# Altium project Radio_SI4432.PrjPcb
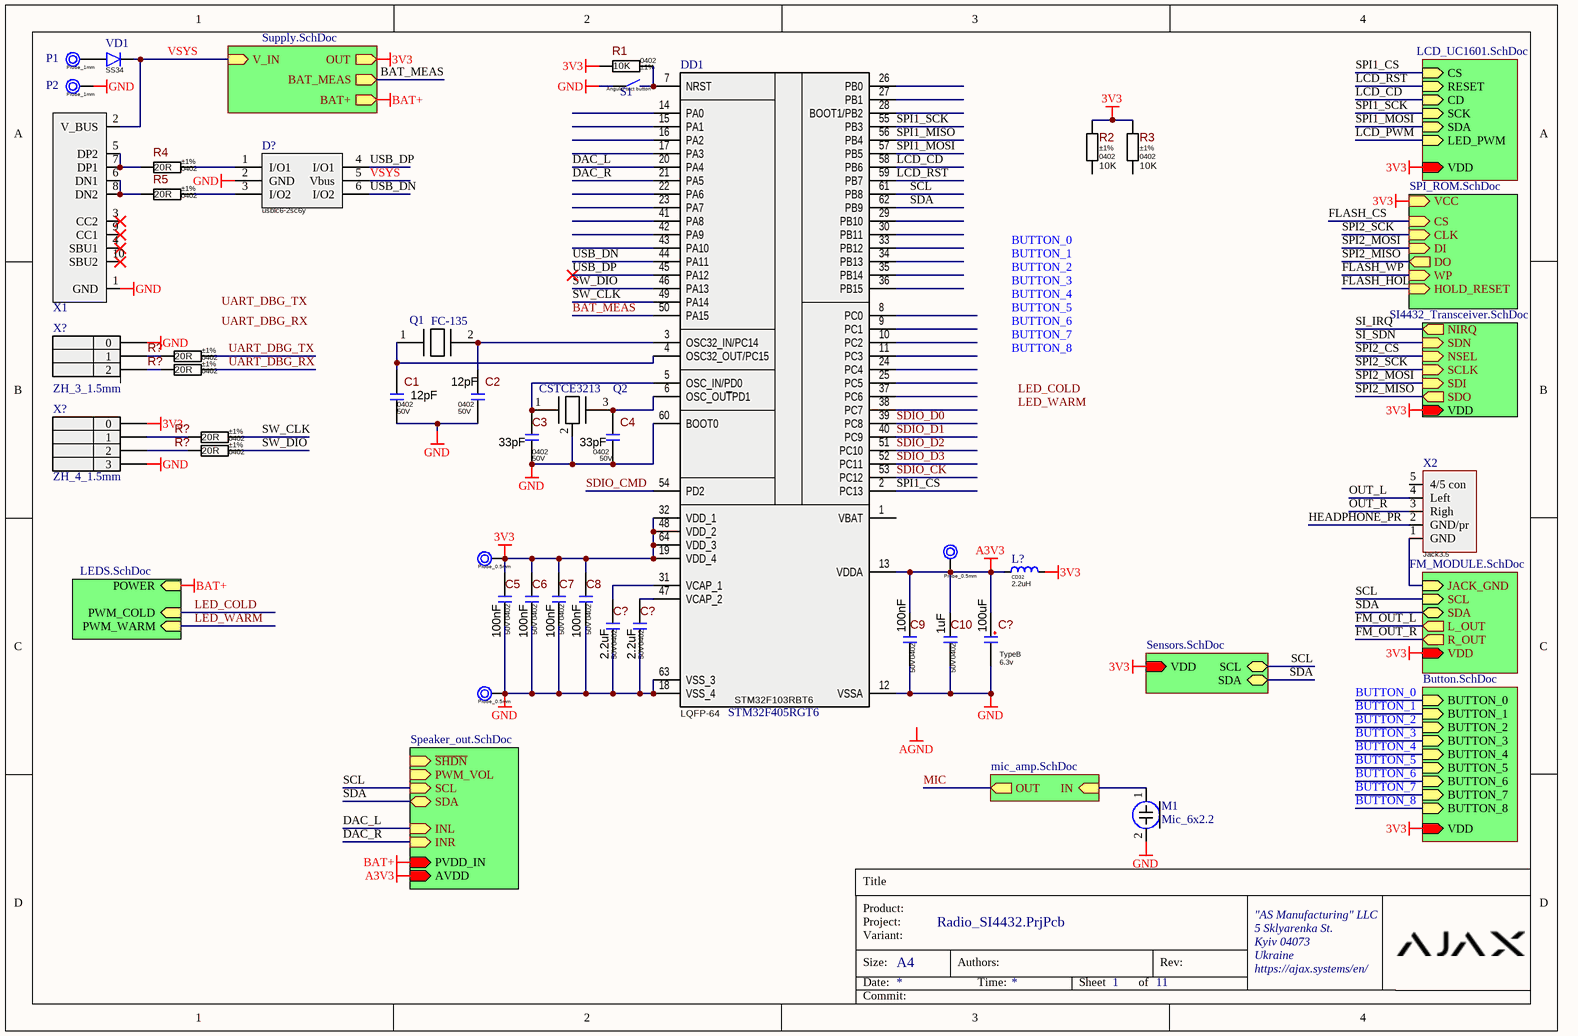
[diagram p0: Main.SchDoc]
11 sheets, 180 parts. Net scope: hierarchical (ports join the sheet entries above them; power ports are global).
Board file: PCB1.PcbDoc
Sheets:
  Main.SchDoc
    Designator = LCD_UC1601.SchDoc
    Designator = Speaker_out.SchDoc
    Designator = Supply.SchDoc
    Designator = SI4432_Transceiver.SchDoc
    Designator = FM_MODULE.SchDoc
    Designator = Button.SchDoc
    IN = mic_amp.SchDoc
    Designator = LEDS.SchDoc
    Designator = SPI_ROM.SchDoc
    Designator = Sensors.SchDoc

## Sheet Main.SchDoc: =DocumentName
size A4; CompanyName: "AS Manufacturing" LLC; Organization: "AS Manufacturing" LLC; Address1: 5 Sklyarenka St.; Address2: Kyiv 04073; Address3: Ukraine; Address4: https://ajax.systems/en/; SheetNumber: 1; SheetTotal: 11; Template_version: 1.0.1

### Parts
(Parts that share a designator on the sheet are numbered #1, #2 ... from top to bottom, then left to right.)
C1  Package: 0402  Voltage: 50V  [Cap_0402]  (hidden comment: 12pF)
C2  Package: 0402  Voltage: 50V  [Cap_0402]  (hidden comment: 12pF)
C3  Package: 0402  Voltage: 50V  [Cap_0402]  (hidden comment: 33pF)
C4  Package: 0402  Voltage: 50V  [Cap_0402]  (hidden comment: 33pF)
C5  Package: 0402  Voltage: 50V  [Cap_0402]  (hidden comment: 100nF)
C6  Package: 0402  Voltage: 50V  [Cap_0402]  (hidden comment: 100nF)
C7  Package: 0402  Voltage: 50V  [Cap_0402]  (hidden comment: 100nF)
C8  Package: 0402  Voltage: 50V  [Cap_0402]  (hidden comment: 100nF)
C9  Package: 0402  Voltage: 50V  [Cap_0402]  (hidden comment: 100nF)
C10  Package: 0402  Voltage: 50V  [Cap_0402]  (hidden comment: 1uF)
C?#1  Package: 0402  Voltage: 50V  [Cap_0402]  (hidden comment: 2.2uF)
C?#2  Package: 0402  Voltage: 50V  [Cap_0402]  (hidden comment: 2.2uF)
C?#3  Package: TypeB  Voltage: 6.3v  [Tantalum TYPE-B]  (hidden comment: 100uF)
D?#1  usblc6-2sc6y  [SOT23-6]
DD1  STM32F405RGT6  Name: STM32F103RBT6  [LQFP-64]
L?#1  value 2.2uH  [CD32]  (hidden comment: CD32)
M1  Mic_6x2.2  [Electret mic 6x2.2]
P1  Probe_1mm  [Probe_1mm]
P2  Probe_1mm  [Probe_1mm]
P15  Probe_0.5mm  [Probe_0.5mm]
P16  Probe_0.5mm  [Probe_0.5mm]
P17  Probe_0.5mm  [Probe_0.5mm]
Q1  FC-135  [Quarz FC-135]
Q2  CSTCE3213  [Quartz MEMS CSTCE]
R1  value 10K  Tolerance: ±1%  Package: 0402  [Res_0402]  (hidden comment: Res_0402_10K)
R2  value 10K  Tolerance: ±1%  Package: 0402  [Res_0402]  (hidden comment: Res_0402_10K)
R3  value 10K  Tolerance: ±1%  Package: 0402  [Res_0402]  (hidden comment: Res_0402_10K)
R4  value 20R  Tolerance: ±1%  Package: 0402  [Res_0402]  (hidden comment: Res_0402_20R)
R5  value 20R  Tolerance: ±1%  Package: 0402  [Res_0402]  (hidden comment: Res_0402_20R)
R?#1  value 20R  Tolerance: ±1%  Package: 0402  [Res_0402]  (hidden comment: Res_0402_20R)
R?#2  value 20R  Tolerance: ±1%  Package: 0402  [Res_0402]  (hidden comment: Res_0402_20R)
R?#3  value 20R  Tolerance: ±1%  Package: 0402  [Res_0402]  (hidden comment: Res_0402_20R)
R?#4  value 20R  Tolerance: ±1%  Package: 0402  [Res_0402]  (hidden comment: Res_0402_20R)
S1  Angular tact button  [Tact_button_3X6X3.5mm]
VD1  SS34  [DO-214AA]
X1  Type-c  [Type-c_0.8]  (value not drawn)
X2  Name: Jack3.5  [Jack3.5_male]  (hidden comment: Jack3.5_male)
X?#1  ZH_3_1.5mm  [ZH_3_1.5mm]
X?#2  ZH_4_1.5mm  [ZH_4_1.5mm]

### Sub-sheets
Designator = LCD_UC1601.SchDoc: CS (in), RESET (in), CD (in), SCK (in), SDA (in), LED_PWM (in), VDD (in)
Designator = Speaker_out.SchDoc: ~{SHDN} (in), PWM_VOL (in), SCL (in), SDA (bidir), INL (in), INR (in), PVDD_IN (in), AVDD (in)
Designator = Supply.SchDoc: OUT (out), V_IN (in), BAT_MEAS (out), BAT+ (out)
Designator = SI4432_Transceiver.SchDoc: NIRQ (out), SDN (in), NSEL (in), SCLK (in), SDI (in), SDO (out), VDD (in)
Designator = FM_MODULE.SchDoc: SCL (in), SDA (bidir), L_OUT (out), R_OUT (out), VDD (in), JACK_GND (in)
Designator = Button.SchDoc: BUTTON_0 (in), VDD (in), BUTTON_1 (in), BUTTON_2 (in), BUTTON_3 (in), BUTTON_4 (in), BUTTON_5 (in), BUTTON_6 (in), BUTTON_7 (in), BUTTON_8 (in)
Designator = LEDS.SchDoc: POWER (in), PWM_COLD (in), PWM_WARM (in)
Designator = SPI_ROM.SchDoc: VCC (in), CS (in), CLK (in), DI (in), DO (out), WP (in), HOLD_RESET (in)
Designator = Sensors.SchDoc: VDD (in), SDA (bidir), SCL (bidir)
IN = mic_amp.SchDoc: OUT (out), IN (in)

### Nets
3V3: C5.1 C6.1 C7.1 C8.1 DD1.19(VDD_4) DD1.32(VDD_1) DD1.48(VDD_2) DD1.64(VDD_3) L?#1.1 P15.1(probe_point) R1.1 R2.1 R3.1 X?#2.0 ; sheet Designator/VDD, sheet Designator/OUT, sheet Designator/VDD, sheet Designator/VDD, sheet Designator/VDD, sheet Designator/VCC, sheet Designator/VDD
A3V3: C9.1 C10.1 C?#3.1 DD1.13(VDDA) L?#1.2 P16.1(probe_point) ; sheet Designator/AVDD
BAT+: sheet Designator/PVDD_IN, sheet Designator/BAT+, sheet Designator/POWER
GND: C1.2 C2.2 C3.2 C4.2 C5.2 C6.2 C7.2 C8.2 C9.2 C10.2 C?#1.2 C?#2.2 C?#3.2 D?#1.2(GND) DD1.12(VSSA) DD1.18(VSS_4) DD1.60(BOOT0) DD1.63(VSS_3) M1.2 P2.1(probe_point) P17.1(probe_point) Q2.2 S1.1 X1.1(GND) X?#1.0 X?#2.3
BAT_MEAS: DD1.50(PA15) ; sheet Designator/BAT_MEAS
DAC_L: DD1.20(PA4) ; sheet Designator/INL
DAC_R: DD1.21(PA5) ; sheet Designator/INR
HEADPHONE_PR: X2.2(GND/pr)
LCD_CD: DD1.58(PB6) ; sheet Designator/CD
LCD_RST: DD1.59(PB7) ; sheet Designator/RESET
OUT_L: X2.4(Left)
OUT_R: X2.3(Righ)
SCL: DD1.61(PB8) ; sheet Designator/SCL, sheet Designator/SCL, sheet Designator/SCL
SDA: DD1.62(PB9) ; sheet Designator/SDA, sheet Designator/SDA, sheet Designator/SDA
SDIO_CK: DD1.53(PC12)
SDIO_CMD: DD1.54(PD2)
SDIO_D0: DD1.39(PC8)
SDIO_D1: DD1.40(PC9)
SDIO_D2: DD1.51(PC10)
SDIO_D3: DD1.52(PC11)
SPI1_CS: DD1.2(PC13) ; sheet Designator/CS
SPI1_MISO: DD1.56(PB4)
SPI1_MOSI: DD1.57(PB5) ; sheet Designator/SDA
SPI1_SCK: DD1.55(PB3) ; sheet Designator/SCK
SPI2_MISO: sheet Designator/SDO, sheet Designator/DO
SPI2_MOSI: sheet Designator/SDI, sheet Designator/DI
SPI2_SCK: sheet Designator/SCLK, sheet Designator/CLK
SW_CLK: DD1.49(PA14) R?#3.2
SW_DIO: DD1.46(PA13) R?#4.2
UART_DBG_RX: R?#2.2
UART_DBG_TX: R?#1.2
USB_DN: D?#1.6(I/O2) DD1.44(PA11)
USB_DP: D?#1.4(I/O1) DD1.45(PA12)
VSYS: D?#1.5(Vbus) VD1.2(C) X1.2(V_BUS) ; sheet Designator/V_IN
NetC1_1: C1.1 DD1.4(OSC32_OUT/PC15) Q1.1(probe_point)
NetC2_1: C2.1 DD1.3(OSC32_IN/PC14) Q1.2(probe_point)
NetC3_1: C3.1 DD1.5(OSC_IN/PD0) Q2.1(probe_point)
NetC4_1: C4.1 DD1.6(OSC_OU~{T}PD1) Q2.3(probe_point)
NetC33_1: X2.1(GND) ; sheet Designator/JACK_GND
NetC46_1: M1.1 ; sheet IN/IN
NetC?#1_1: C?#1.1 DD1.31(VCAP_1)
NetC?#2_1: C?#2.1 DD1.47(VCAP_2)
NetD?#1_1: D?#1.1(I/O1) R4.2
NetD?#1_3: D?#1.3(I/O2) R5.2
NetDD1_7: DD1.7(NRST) R1.2 S1.2
NetP1_1: P1.1(probe_point) VD1.1(A)
NetR4_1: R4.1 X1.5(DP2) X1.7(DP1)
NetR5_1: R5.1 X1.6(DN1) X1.8(DN2)
NetR?#1_1: R?#1.1 X?#1.1
NetR?#2_1: R?#2.1 X?#1.2
NetR?#3_1: R?#3.1 X?#2.1
NetR?#4_1: R?#4.1 X?#2.2

Not connected (* = marked no-connect by the designer): DD1 1(VBAT) 8(PC0) 9(PC1) 10(PC2) 11(PC3) 14(PA0) 15(PA1) 16(PA2) 17(PA3) 22(PA6) 23(PA7) 24(PC4) 25(PC5) 26(PB0) 27(PB1) 28(BOOT1/PB2) 29(PB10) 30(PB11) 33(PB12) 34(PB13) 35(PB14) 36(PB15) 37(PC6) 38(PC7) 41(PA8) 42(PA9) 43(PA10); R2 2; R3 2; X1 3(CC2)* 4(SBU1)* 9(CC1)* 10(SBU2)*; X2 5(4/5_con)

### Notes on the sheet
- Labels drawn without touching a wire or pin: AGND, BUTTON_0, BUTTON_1, BUTTON_2, BUTTON_3, BUTTON_4, BUTTON_5, BUTTON_6, BUTTON_7, BUTTON_8, LED_COLD, LED_WARM, UART_DBG_RX, UART_DBG_TX
- Title
- Product:
- Project:
- Size:
- Date:
- Variant:
- A4
- Authors:
- Time:
- Sheet
- of
- Rev:
- Commit:

### Library data of the parts
C1 C2 = Cap_0402_12pF: 12pF 50V  ±25% 0402 Ceramic Capacitor; Component Type: SMD; Tolerance: ±25%; ComponentLink1URL: https://search.murata.co.jp/Ceramy/image/img/A01X/G101/ENG/GRM31CR60J107ME39-01.pdf; ComponentLink1Description: Datasheet; Value: 12pF
C3 C4 = Cap_0402_33pF: 33pF 50V  ±25% 0402 Ceramic Capacitor; Component Type: SMD; Tolerance: ±25%; ComponentLink1URL: https://search.murata.co.jp/Ceramy/image/img/A01X/G101/ENG/GRM31CR60J107ME39-01.pdf; ComponentLink1Description: Datasheet; Value: 33pF
C5-C9 = Cap_0402_100nF: 100nF 50V  ±25% 0402 Ceramic Capacitor; Component Type: SMD; Tolerance: ±25%; ComponentLink1URL: https://search.murata.co.jp/Ceramy/image/img/A01X/G101/ENG/GRM31CR60J107ME39-01.pdf; ComponentLink1Description: Datasheet; Value: 100nF
C10 = Cap_0402_1uF: 1uF 50V  ±25% 0402 Ceramic Capacitor; Component Type: SMD; Tolerance: ±25%; ComponentLink1URL: https://search.murata.co.jp/Ceramy/image/img/A01X/G101/ENG/GRM31CR60J107ME39-01.pdf; ComponentLink1Description: Datasheet; Value: 1uF
C?#1 C?#2 = Cap_0402_2.2uF: 2.2uF 50V  ±25% 0402 Ceramic Capacitor; Component Type: SMD; Tolerance: ±25%; ComponentLink1URL: https://search.murata.co.jp/Ceramy/image/img/A01X/G101/ENG/GRM31CR60J107ME39-01.pdf; ComponentLink1Description: Datasheet; Value: 2.2uF
C?#3 = Cap_TypeB_100uF: Tantalum_TYPE-B 100uF 6.3V; Tolerance: ±25%; ComponentLink1URL: https://search.murata.co.jp/Ceramy/image/img/A01X/G101/ENG/GRM31CR60J107ME39-01.pdf; ComponentLink1Description: Datasheet; Component Type: SMD; Value: 100uF
DD1 = STM32F405RGT6: ARM Cortex-M3 MCU with 1024 kB Flash 192kB ROM, 168 MHz CPU, LQFP-64; Manufacturer: STMicroelectronics; Component Type: SMD; Package: LQFP-64
L?#1 = CD32: 2.2uH; Size: CD32
Q1 = Quarz 32.768kHz: Parameter 1: *
Q2 = CSTCE3213: QUARZ 8MHz; Parameter 1: *
R1-R3 = Res_0402_10K: ±1% 1/16W 0402; Power Rating: 0.062W; Voltage: 50V; ComponentLink1URL: https://www.yageo.com/upload/media/product/productsearch/datasheet/rchip/PYu-RC_Group_51_RoHS_L_10.pdf; ComponentLink1Description: Datasheet
R4 R5 R?#1-R?#4 = Res_0402_20R: ±1% 1/16W 0402; Power Rating: 0.062W; Voltage: 50V; ComponentLink1URL: https://www.yageo.com/upload/media/product/productsearch/datasheet/rchip/PYu-RC_Group_51_RoHS_L_10.pdf; ComponentLink1Description: Datasheet
S1 = Angular tact button: 3X6X3.5mm; Name: Angular tact button
VD1 = SS34: Shotky diode 40v 3A (drop 0.75v 3A); Name: SS34
X1 = USB_Type-c_0.8mm
D?#1 = usblc6-2sc6y: Name: usblc6-2sc6y
P1 P2 = Probe_1mm: Value: Probe_1mm
P15-P17 = Probe_0.5mm: Value: Probe_0.5mm

## Sheet LCD_UC1601.SchDoc
size A4; SheetNumber: 3; SheetTotal: 11
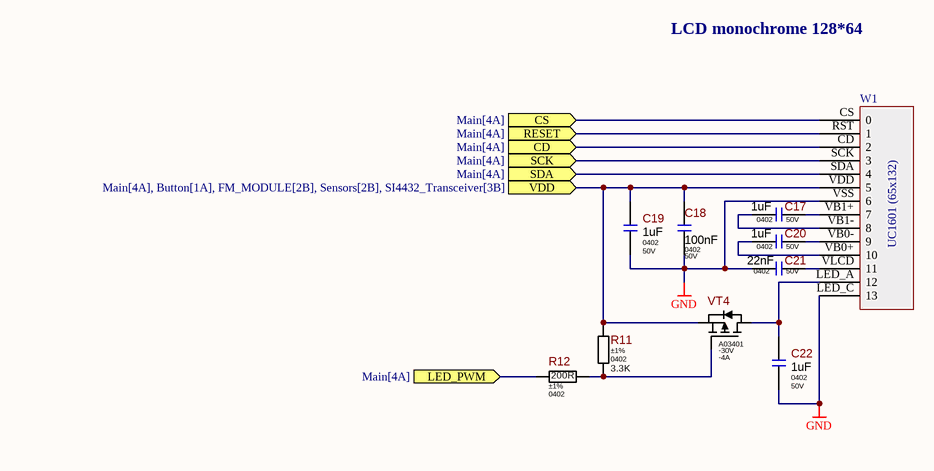
[diagram p1: LCD_UC1601.SchDoc]

### Parts
C17  Package: 0402  Voltage: 50V  [Cap_0402]  (hidden comment: 1uF)
C18  Package: 0402  Voltage: 50V  [Cap_0402]  (hidden comment: 100nF)
C19  Package: 0402  Voltage: 50V  [Cap_0402]  (hidden comment: 1uF)
C20  Package: 0402  Voltage: 50V  [Cap_0402]  (hidden comment: 1uF)
C21  Package: 0402  Voltage: 50V  [Cap_0402]  (hidden comment: 22nF)
C22  Package: 0402  Voltage: 50V  [Cap_0402]  (hidden comment: 1uF)
R11  value 3.3K  Tolerance: ±1%  Package: 0402  [Res_0402]  (hidden comment: Res_0402_3.3K)
R12  value 200R  Tolerance: ±1%  Package: 0402  [Res_0402]  (hidden comment: Res_0402_200R)
VT4  Vds: -30V  Id: -4A  [SOT-23]  (hidden comment: A03401)
W1  LCD_UC1601s  [LCD_connector_14PIN_0.5mm]  (value not drawn)

### Ports
CD (in, see Main[4A]), CS (in, see Main[4A]), LED_PWM (in, see Main[4A]), RESET (in, see Main[4A]), SCK (in, see Main[4A]), SDA (in, see Main[4A]), VDD (in, see Main[4A], Button[1A], FM_MODULE[2B], Sensors[2B], SI4432_Transceiver[3B])

### Nets
3V3: C18.1 C19.1 R11.2 VT4.2(S) W1.VDD(5) ; port VDD
GND: C18.2 C19.2 C21.1 C22.2 W1.LED_C(13) W1.VSS(6)
LCD_CD: W1.CD(2) ; port CD
LCD_PWM: R12.1 ; port LED_PWM
LCD_RST: W1.RST(1) ; port RESET
SPI1_CS: W1.CS(0) ; port CS
SPI1_MOSI: W1.SDA(4) ; port SDA
SPI1_SCK: W1.SCK(3) ; port SCK
NetC17_1: C17.1 W1.VB1-(8)
NetC17_2: C17.2 W1.VB1+(7)
NetC20_1: C20.1 W1.VB0+(10)
NetC20_2: C20.2 W1.VB0-(9)
NetC21_2: C21.2 W1.VLCD(11)
NetC22_1: C22.1 VT4.3(D) W1.LED_A(12)
NetR11_1: R11.1 R12.2 VT4.1(G)

### Notes on the sheet
- LCD monochrome 128*64
- (in symbol LCD_UC1601s) UC1601 (65x132)

### Library data of the parts
C17 C19 C20 C22 = Cap_0402_1uF: 1uF 50V  ±25% 0402 Ceramic Capacitor; Component Type: SMD; Tolerance: ±25%; ComponentLink1URL: https://search.murata.co.jp/Ceramy/image/img/A01X/G101/ENG/GRM31CR60J107ME39-01.pdf; ComponentLink1Description: Datasheet; Value: 1uF
C18 = Cap_0402_100nF: 100nF 50V  ±25% 0402 Ceramic Capacitor; Component Type: SMD; Tolerance: ±25%; ComponentLink1URL: https://search.murata.co.jp/Ceramy/image/img/A01X/G101/ENG/GRM31CR60J107ME39-01.pdf; ComponentLink1Description: Datasheet; Value: 100nF
C21 = Cap_0402_22nF: 22nF 50V  ±25% 0402 Ceramic Capacitor; Component Type: SMD; Tolerance: ±25%; ComponentLink1URL: https://search.murata.co.jp/Ceramy/image/img/A01X/G101/ENG/GRM31CR60J107ME39-01.pdf; ComponentLink1Description: Datasheet; Value: 22nF
R11 = Res_0402_3.3K: ±1% 1/16W 0402; Power Rating: 0.062W; Voltage: 50V; ComponentLink1URL: https://www.yageo.com/upload/media/product/productsearch/datasheet/rchip/PYu-RC_Group_51_RoHS_L_10.pdf; ComponentLink1Description: Datasheet
R12 = Res_0402_200R: ±1% 1/16W 0402; Power Rating: 0.062W; Voltage: 50V; ComponentLink1URL: https://www.yageo.com/upload/media/product/productsearch/datasheet/rchip/PYu-RC_Group_51_RoHS_L_10.pdf; ComponentLink1Description: Datasheet
VT4 = A03401: -30V, -4A max P-Channel  MOSFET, 60mOhm @ Vgs = -4.5V; Part Type: N-Channel; Component Type: SMD; ComponentLink1URL: https://datasheetspdf.com/pdf-file/767558/Alpha&OmegaSemiconductors/AO3416/1; ComponentLink1Description: Datasheet; Package: SOT-23; Rds: 60mOhm; Name: A03401

## Sheet Speaker_out.SchDoc: =DocumentName
size A4; CompanyName: "AS Manufacturing" LLC; Organization: "AS Manufacturing" LLC; Address1: 5 Sklyarenka St.; Address2: Kyiv 04073; Address3: Ukraine; Address4: https://ajax.systems/en/; SheetNumber: 2; SheetTotal: 11; Template_version: 1.0.1
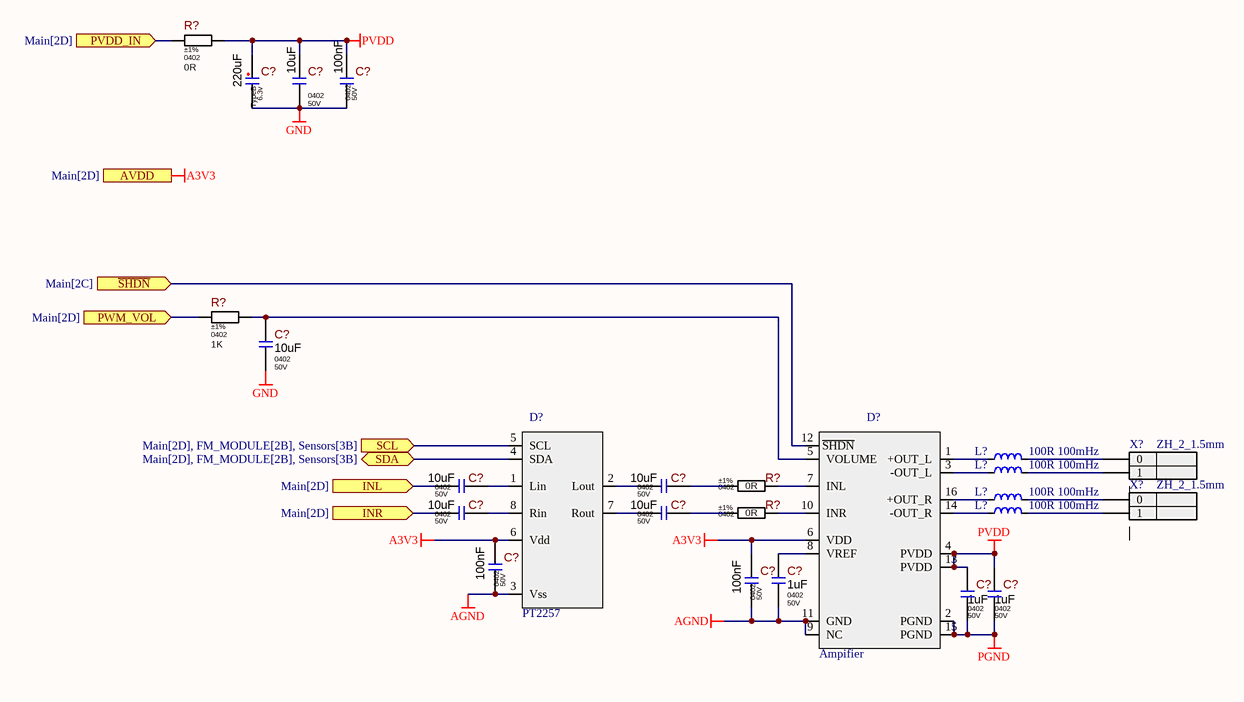
[diagram p2: Speaker_out.SchDoc]

### Parts
(Parts that share a designator on the sheet are numbered #1, #2 ... from top to bottom, then left to right.)
C?#4  Package: TypeB  Voltage: 6.3v  [Tantalum TYPE-B]  (hidden comment: 220uF)
C?#5  Package: 0402  Voltage: 50V  [Cap_0402]  (hidden comment: 10uF)
C?#6  Package: 0402  Voltage: 50V  [Cap_0402]  (hidden comment: 100nF)
C?#7  Package: 0402  Voltage: 50V  [Cap_0402]  (hidden comment: 10uF)
C?#8  Package: 0402  Voltage: 50V  [Cap_0402]  (hidden comment: 10uF)
C?#9  Package: 0402  Voltage: 50V  [Cap_0402]  (hidden comment: 10uF)
C?#10  Package: 0402  Voltage: 50V  [Cap_0402]  (hidden comment: 10uF)
C?#11  Package: 0402  Voltage: 50V  [Cap_0402]  (hidden comment: 10uF)
C?#12  Package: 0402  Voltage: 50V  [Cap_0402]  (hidden comment: 100nF)
C?#13  Package: 0402  Voltage: 50V  [Cap_0402]  (hidden comment: 100nF)
C?#14  Package: 0402  Voltage: 50V  [Cap_0402]  (hidden comment: 1uF)
C?#15  Package: 0402  Voltage: 50V  [Cap_0402]  (hidden comment: 1uF)
C?#16  Package: 0402  Voltage: 50V  [Cap_0402]  (hidden comment: 1uF)
D?#2  PT2257  [SOP8]
D?#3  Ampifier  [SOP16]
L?#2  100R 100mHz  [Cap_0805]
L?#3  100R 100mHz  [Cap_0805]
L?#4  100R 100mHz  [Cap_0805]
L?#5  100R 100mHz  [Cap_0805]
R?#5  value 0R  Tolerance: ±1%  Package: 0402  [Res_0402]  (hidden comment: Res_0402_0R)
R?#6  value 1K  Tolerance: ±1%  Package: 0402  [Res_0402]  (hidden comment: Res_0402_1K)
R?#7  value 0R  Tolerance: ±1%  Package: 0402  [Res_0402]  (hidden comment: Res_0402_0R)
R?#8  value 0R  Tolerance: ±1%  Package: 0402  [Res_0402]  (hidden comment: Res_0402_0R)
X?#3  ZH_2_1.5mm  [ZH_2_1.5mm]
X?#4  ZH_2_1.5mm  [ZH_2_1.5mm]

### Ports
AVDD (in, see Main[2D]), INL (in, see Main[2D]), INR (in, see Main[2D]), PVDD_IN (in, see Main[2D]), PWM_VOL (in, see Main[2D]), SCL (in, see Main[2D], FM_MODULE[2B], Sensors[3B]), SDA (bidir, see Main[2D], FM_MODULE[2B], Sensors[3B]), ~{SHDN} (in, see Main[2C])

### Nets
A3V3: C?#12.1 C?#13.1 D?#2.6(Vdd) D?#3.6(VDD) ; port AVDD
AGND: C?#12.2 C?#13.2 C?#14.2 D?#2.3(Vss) D?#3.9(NC) D?#3.11(GND)
BAT+: R?#5.1 ; port PVDD_IN
GND: C?#4.2 C?#5.2 C?#6.2 C?#7.2
PGND: C?#15.2 C?#16.2 D?#3.2(PGND) D?#3.15(PGND)
PVDD: C?#4.1 C?#5.1 C?#6.1 C?#15.1 C?#16.1 D?#3.4(PVDD) D?#3.13(PVDD) R?#5.2
DAC_L: C?#8.1 ; port INL
DAC_R: C?#10.1 ; port INR
SCL: D?#2.5(SCL) ; port SCL
SDA: D?#2.4(SDA) ; port SDA
NetC?#7_1: C?#7.1 D?#3.5(VOLUME) R?#6.2
NetC?#8_2: C?#8.2 D?#2.1(Lin)
NetC?#9_1: C?#9.1 D?#2.2(Lout)
NetC?#9_2: C?#9.2 R?#7.1
NetC?#10_2: C?#10.2 D?#2.8(Rin)
NetC?#11_1: C?#11.1 D?#2.7(Rout)
NetC?#11_2: C?#11.2 R?#8.1
NetC?#14_1: C?#14.1 D?#3.8(VREF)
NetD?#3_1: D?#3.1(+OUT_L) L?#2.1
NetD?#3_3: D?#3.3(-OUT_L) L?#3.1
NetD?#3_7: D?#3.7(INL) R?#7.2
NetD?#3_10: D?#3.10(INR) R?#8.2
NetD?#3_12: D?#3.12(~{SHDN}) ; port ~{SHDN}
NetD?#3_14: D?#3.14(-OUT_R) L?#5.1
NetD?#3_16: D?#3.16(+OUT_R) L?#4.1
NetL?#2_2: L?#2.2 X?#3.0
NetL?#3_2: L?#3.2 X?#3.1
NetL?#4_2: L?#4.2 X?#4.0
NetL?#5_2: L?#5.2 X?#4.1
NetR?#6_1: R?#6.1 ; port PWM_VOL

### Notes on the sheet
- Title
- Product:
- Project:
- Size:
- Date:
- Variant:
- A4
- Authors:
- Time:
- Sheet
- of
- Rev:
- Commit:

### Library data of the parts
C?#4 = Cap_TypeB_220uF: Tantalum_TYPE-B 220uF 6.3V; Tolerance: ±25%; ComponentLink1URL: https://search.murata.co.jp/Ceramy/image/img/A01X/G101/ENG/GRM31CR60J107ME39-01.pdf; ComponentLink1Description: Datasheet; Component Type: SMD; Value: 220uF
C?#5 C?#7-C?#11 = Cap_0402_10uF: 10uF 50V  ±25% 0402 Ceramic Capacitor; Component Type: SMD; Tolerance: ±25%; ComponentLink1URL: https://search.murata.co.jp/Ceramy/image/img/A01X/G101/ENG/GRM31CR60J107ME39-01.pdf; ComponentLink1Description: Datasheet; Value: 10uF
C?#6 C?#12 C?#13 = Cap_0402_100nF: 100nF 50V  ±25% 0402 Ceramic Capacitor; Component Type: SMD; Tolerance: ±25%; ComponentLink1URL: https://search.murata.co.jp/Ceramy/image/img/A01X/G101/ENG/GRM31CR60J107ME39-01.pdf; ComponentLink1Description: Datasheet; Value: 100nF
C?#14-C?#16 = Cap_0402_1uF: 1uF 50V  ±25% 0402 Ceramic Capacitor; Component Type: SMD; Tolerance: ±25%; ComponentLink1URL: https://search.murata.co.jp/Ceramy/image/img/A01X/G101/ENG/GRM31CR60J107ME39-01.pdf; ComponentLink1Description: Datasheet; Value: 1uF
D?#2 = PT2257: Digital potentiometr
D?#3 = PAM8003: Amplifier 2.5W class-d stereo / 64-Step DC Volume Control
L?#2-L?#5 = FerriteBead_0805_100R_100Mhz_1
R?#5 R?#7 R?#8 = Res_0402_0R: ±1% 1/16W 0402; Power Rating: 0.062W; Voltage: 50V; ComponentLink1URL: https://www.yageo.com/upload/media/product/productsearch/datasheet/rchip/PYu-RC_Group_51_RoHS_L_10.pdf; ComponentLink1Description: Datasheet
R?#6 = Res_0402_1K: ±1% 1/16W 0402; Power Rating: 0.062W; Voltage: 50V; ComponentLink1URL: https://www.yageo.com/upload/media/product/productsearch/datasheet/rchip/PYu-RC_Group_51_RoHS_L_10.pdf; ComponentLink1Description: Datasheet

## Sheet Supply.SchDoc: =DocumentName
size A4; CompanyName: "AS Manufacturing" LLC; Organization: "AS Manufacturing" LLC; Address1: 5 Sklyarenka St.; Address2: Kyiv 04073; Address3: Ukraine; Address4: https://ajax.systems/en/; SheetNumber: 1; SheetTotal: 1; Template_version: 1.0.1
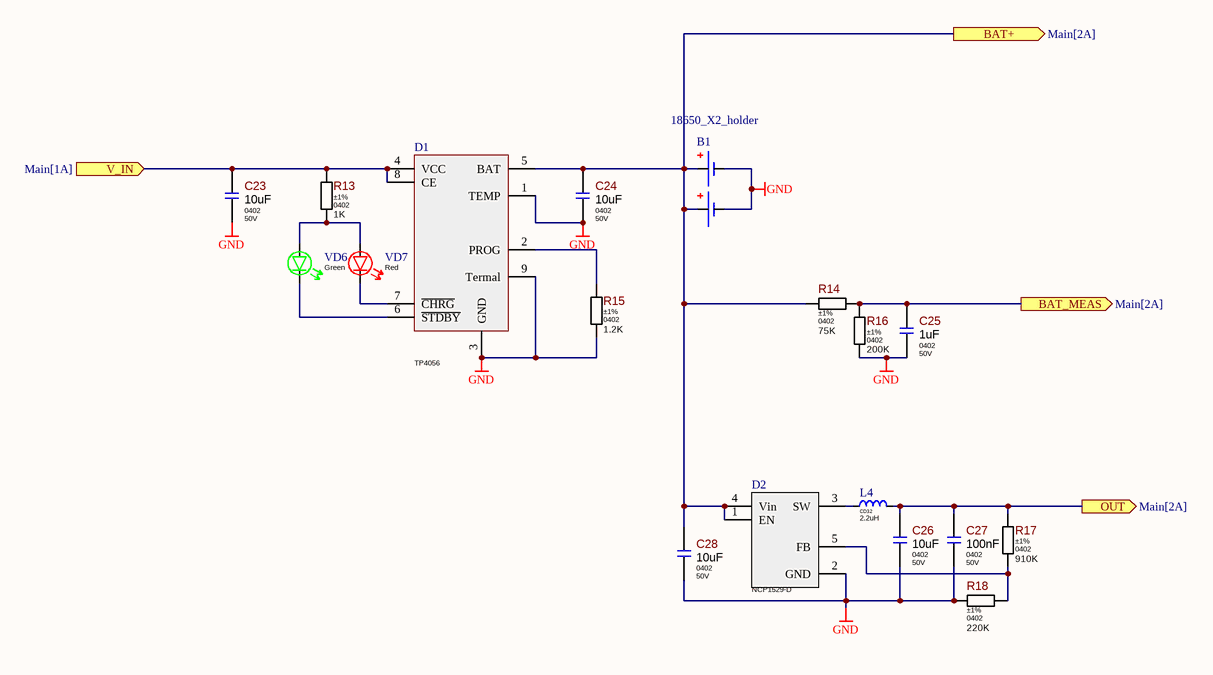
[diagram p3: Supply.SchDoc]

### Parts
B1  18650_X2_holder  [18650_X2]
C23  Package: 0402  Voltage: 50V  [Cap_0402]  (hidden comment: 10uF)
C24  Package: 0402  Voltage: 50V  [Cap_0402]  (hidden comment: 10uF)
C25  Package: 0402  Voltage: 50V  [Cap_0402]  (hidden comment: 1uF)
C26  Package: 0402  Voltage: 50V  [Cap_0402]  (hidden comment: 10uF)
C27  Package: 0402  Voltage: 50V  [Cap_0402]  (hidden comment: 100nF)
C28  Package: 0402  Voltage: 50V  [Cap_0402]  (hidden comment: 10uF)
D1  TP4056  [SOP-8-with thermal pad]
D2  NCP1529-D  [SOT-23-5]
L4  value 2.2uH  [CD32]  (hidden comment: CD32)
R13  value 1K  Tolerance: ±1%  Package: 0402  [Res_0402]  (hidden comment: Res_0402_1K)
R14  value 75K  Tolerance: ±1%  Package: 0402  [Res_0402]  (hidden comment: Res_0402_75K)
R15  value 1.2K  Tolerance: ±1%  Package: 0402  [Res_0402]  (hidden comment: Res_0402_1.2K)
R16  value 200K  Tolerance: ±1%  Package: 0402  [Res_0402]  (hidden comment: Res_0402_200K)
R17  value 910K  Tolerance: ±1%  Package: 0402  [Res_0402]  (hidden comment: Res_0402_910K)
R18  value 220K  Tolerance: ±1%  Package: 0402  [Res_0402]  (hidden comment: Res_0402_220K)
VD6  Color: Green  [0805_LED_GREEN]  (hidden comment: 0805_LED_GREEN)
VD7  Color: Red  [0805_LED_RED]  (hidden comment: 0805_LED_RED)

### Ports
BAT+ (out, see Main[2A]), BAT_MEAS (out, see Main[2A]), OUT (out, see Main[2A]), V_IN (in, see Main[1A])

### Nets
3V3: C26.1 C27.1 L4.2 R17.1 ; port OUT
BAT+: B1.1(+) B1.3(+) C24.1 C28.1 D1.5(BAT) D2.1(EN) D2.4(Vin) R14.1 ; port BAT+
GND: B1.2(-) B1.4(-) C23.2 C24.2 C25.1 C26.2 C27.2 C28.2 D1.1(TEMP) D1.3(GND) D1.9(Termal) D2.2(GND) R15.2 R16.2 R18.2
BAT_MEAS: C25.2 R14.2 R16.1 ; port BAT_MEAS
VSYS: C23.1 D1.4(VCC) D1.8(CE) R13.1 ; port V_IN
NetD1_2: D1.2(PROG) R15.1
NetD1_6: D1.6(~{STDBY}) VD6.2(C)
NetD1_7: D1.7(~{CHRG}) VD7.2(C)
NetD2_3: D2.3(SW) L4.1
NetD2_5: D2.5(FB) R17.2 R18.1
NetR13_2: R13.2 VD6.1(A) VD7.1(A)

### Notes on the sheet
- Title
- Product:
- Project:
- Size:
- Date:
- Variant:
- A4
- Authors:
- Time:
- Sheet
- of
- Rev:
- Commit:

### Library data of the parts
C23 C24 C26 C28 = Cap_0402_10uF: 10uF 50V  ±25% 0402 Ceramic Capacitor; Component Type: SMD; Tolerance: ±25%; ComponentLink1URL: https://search.murata.co.jp/Ceramy/image/img/A01X/G101/ENG/GRM31CR60J107ME39-01.pdf; ComponentLink1Description: Datasheet; Value: 10uF
C25 = Cap_0402_1uF: 1uF 50V  ±25% 0402 Ceramic Capacitor; Component Type: SMD; Tolerance: ±25%; ComponentLink1URL: https://search.murata.co.jp/Ceramy/image/img/A01X/G101/ENG/GRM31CR60J107ME39-01.pdf; ComponentLink1Description: Datasheet; Value: 1uF
C27 = Cap_0402_100nF: 100nF 50V  ±25% 0402 Ceramic Capacitor; Component Type: SMD; Tolerance: ±25%; ComponentLink1URL: https://search.murata.co.jp/Ceramy/image/img/A01X/G101/ENG/GRM31CR60J107ME39-01.pdf; ComponentLink1Description: Datasheet; Value: 100nF
D1 = TP4056: Lion Charger 1A; Name: TP4056
D2 = NCP1529-D: In 2.7-5.5v 1A 1.7MHz DC-DC; Name: NCP1529-D
L4 = CD32: 2.2uH; Size: CD32
R13 = Res_0402_1K: as R?#6 on sheet Speaker_out; ComponentLink1URL: https://www.yageo.com/upload/media/product/productsearch/datasheet/rchip/PYu-RC_Group_51_RoHS_L_10.pdf; ComponentLink1Description: Datasheet
R14 = Res_0402_75K: ±1% 1/16W 0402; Power Rating: 0.062W; Voltage: 50V; ComponentLink1URL: https://www.yageo.com/upload/media/product/productsearch/datasheet/rchip/PYu-RC_Group_51_RoHS_L_10.pdf; ComponentLink1Description: Datasheet
R15 = Res_0402_1.2K: ±1% 1/16W 0402; Power Rating: 0.062W; Voltage: 50V; ComponentLink1URL: https://www.yageo.com/upload/media/product/productsearch/datasheet/rchip/PYu-RC_Group_51_RoHS_L_10.pdf; ComponentLink1Description: Datasheet
R16 = Res_0402_200K: ±1% 1/16W 0402; Power Rating: 0.062W; Voltage: 50V; ComponentLink1URL: https://www.yageo.com/upload/media/product/productsearch/datasheet/rchip/PYu-RC_Group_51_RoHS_L_10.pdf; ComponentLink1Description: Datasheet
R17 = Res_0402_910K: ±1% 1/16W 0402; Power Rating: 0.062W; Voltage: 50V; ComponentLink1URL: https://www.yageo.com/upload/media/product/productsearch/datasheet/rchip/PYu-RC_Group_51_RoHS_L_10.pdf; ComponentLink1Description: Datasheet
R18 = Res_0402_220K: ±1% 1/16W 0402; Power Rating: 0.062W; Voltage: 50V; ComponentLink1URL: https://www.yageo.com/upload/media/product/productsearch/datasheet/rchip/PYu-RC_Group_51_RoHS_L_10.pdf; ComponentLink1Description: Datasheet
VD6 = 0805_LED_GREEN: V=3v - 3.2v / I=20mA
VD7 = 0805_LED_RED: V=2v - 2.2v / I=20mA

## Sheet SI4432_Transceiver.SchDoc
size A4; SheetNumber: 5; SheetTotal: 11
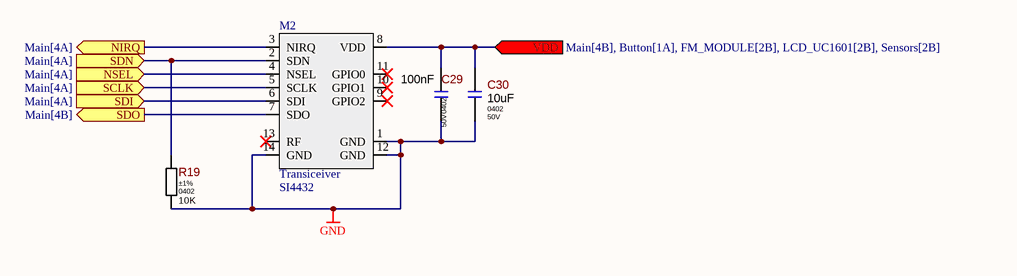
[diagram p4: SI4432_Transceiver.SchDoc]

### Parts
C29  Package: 0402  Voltage: 50V  [Cap_0402]  (hidden comment: 100nF)
C30  Package: 0402  Voltage: 50V  [Cap_0402]  (hidden comment: 10uF)
M2  Transiceiver  [SI4432]
R19  value 10K  Tolerance: ±1%  Package: 0402  [Res_0402]  (hidden comment: Res_0402_10K)

### Ports
NIRQ (out, see Main[4A]), NSEL (in, see Main[4A]), SCLK (in, see Main[4A]), SDI (in, see Main[4A]), SDN (in, see Main[4A]), SDO (out, see Main[4B]), VDD (in, see Main[4B], Button[1A], FM_MODULE[2B], LCD_UC1601[2B], Sensors[2B])

### Nets
3V3: C29.1 C30.1 M2.8(VDD) ; port VDD
GND: C29.2 C30.2 M2.1(GND) M2.12(GND) M2.14(GND) R19.2
SI_IRQ: M2.3(NIRQ) ; port NIRQ
SI_SDN: M2.2(SDN) R19.1 ; port SDN
SPI2_CS: M2.4(NSEL) ; port NSEL
SPI2_MISO: M2.7(SDO) ; port SDO
SPI2_MOSI: M2.6(SDI) ; port SDI
SPI2_SCK: M2.5(SCLK) ; port SCLK

Not connected (* = marked no-connect by the designer): M2 9(GPIO2)* 10(GPIO1)* 11(GPIO0)* 13(RF)*

### Library data of the parts
C29 = Cap_0402_100nF: 100nF 50V  ±25% 0402 Ceramic Capacitor; Component Type: SMD; Tolerance: ±25%; ComponentLink1URL: https://search.murata.co.jp/Ceramy/image/img/A01X/G101/ENG/GRM31CR60J107ME39-01.pdf; ComponentLink1Description: Datasheet; Value: 100nF
C30 = Cap_0402_10uF: 10uF 50V  ±25% 0402 Ceramic Capacitor; Component Type: SMD; Tolerance: ±25%; ComponentLink1URL: https://search.murata.co.jp/Ceramy/image/img/A01X/G101/ENG/GRM31CR60J107ME39-01.pdf; ComponentLink1Description: Datasheet; Value: 10uF
M2 = SI4432: Name: SI4432
R19 = Res_0402_10K: as R1 on sheet Main; ComponentLink1URL: https://www.yageo.com/upload/media/product/productsearch/datasheet/rchip/PYu-RC_Group_51_RoHS_L_10.pdf; ComponentLink1Description: Datasheet

## Sheet FM_MODULE.SchDoc
size A4; SheetNumber: 6; SheetTotal: 11
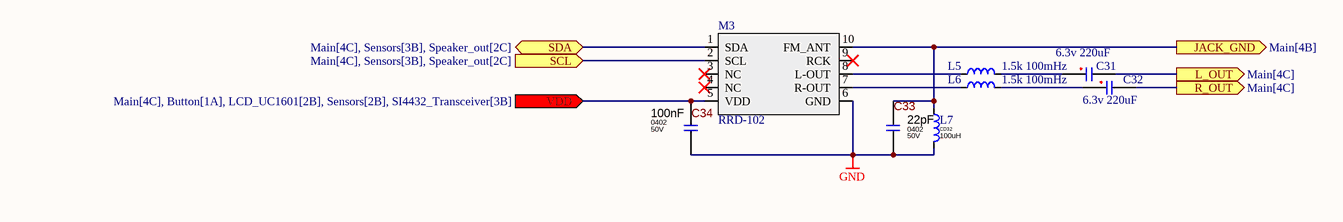
[diagram p5: FM_MODULE.SchDoc]

### Parts
C31  6.3v 220uF  [Tantalum TYPE-B]
C32  6.3v 220uF  [Tantalum TYPE-B]
C33  Package: 0402  Voltage: 50V  [Cap_0402]  (hidden comment: 22pF)
C34  Package: 0402  Voltage: 50V  [Cap_0402]  (hidden comment: 100nF)
L5  1.5k 100mHz  [Cap_0805]
L6  1.5k 100mHz  [Cap_0805]
L7  value 100uH  [CD32]  (hidden comment: CD32)
M3  RRD-102  [RRD-102]

### Ports
JACK_GND (out, see Main[4B]), L_OUT (out, see Main[4C]), R_OUT (out, see Main[4C]), SCL (in, see Main[4C], Sensors[3B], Speaker_out[2C]), SDA (bidir, see Main[4C], Sensors[3B], Speaker_out[2C]), VDD (in, see Main[4C], Button[1A], LCD_UC1601[2B], Sensors[2B], SI4432_Transceiver[3B])

### Nets
3V3: C34.1 M3.5(VDD) ; port VDD
GND: C33.2 C34.2 L7.2 M3.6(GND)
FM_OUT_L: C31.2 ; port L_OUT
FM_OUT_R: C32.2 ; port R_OUT
SCL: M3.2(SCL) ; port SCL
SDA: M3.1(SDA) ; port SDA
NetC31_1: C31.1 L5.2
NetC32_1: C32.1 L6.2
NetC33_1: C33.1 L7.1 M3.10(FM_ANT) ; port JACK_GND
NetL5_1: L5.1 M3.8(L-OUT)
NetL6_1: L6.1 M3.7(R-OUT)

Not connected (* = marked no-connect by the designer): M3 3(NC)* 4(NC)* 9(RCK)*

### Library data of the parts
C31 C32 = Tantalum_TYPE-B
C33 = Cap_0402_22pF: 22pF 50V  ±25% 0402 Ceramic Capacitor; Component Type: SMD; Tolerance: ±25%; ComponentLink1URL: https://search.murata.co.jp/Ceramy/image/img/A01X/G101/ENG/GRM31CR60J107ME39-01.pdf; ComponentLink1Description: Datasheet; Value: 22pF
C34 = Cap_0402_100nF: 100nF 50V  ±25% 0402 Ceramic Capacitor; Component Type: SMD; Tolerance: ±25%; ComponentLink1URL: https://search.murata.co.jp/Ceramy/image/img/A01X/G101/ENG/GRM31CR60J107ME39-01.pdf; ComponentLink1Description: Datasheet; Value: 100nF
L5 L6 = 0805
L7 = CD32: 2.2uH; Size: CD32
M3 = RRD-102(RDA5807M)

## Sheet Button.SchDoc
size A4; SheetNumber: 7; SheetTotal: 11
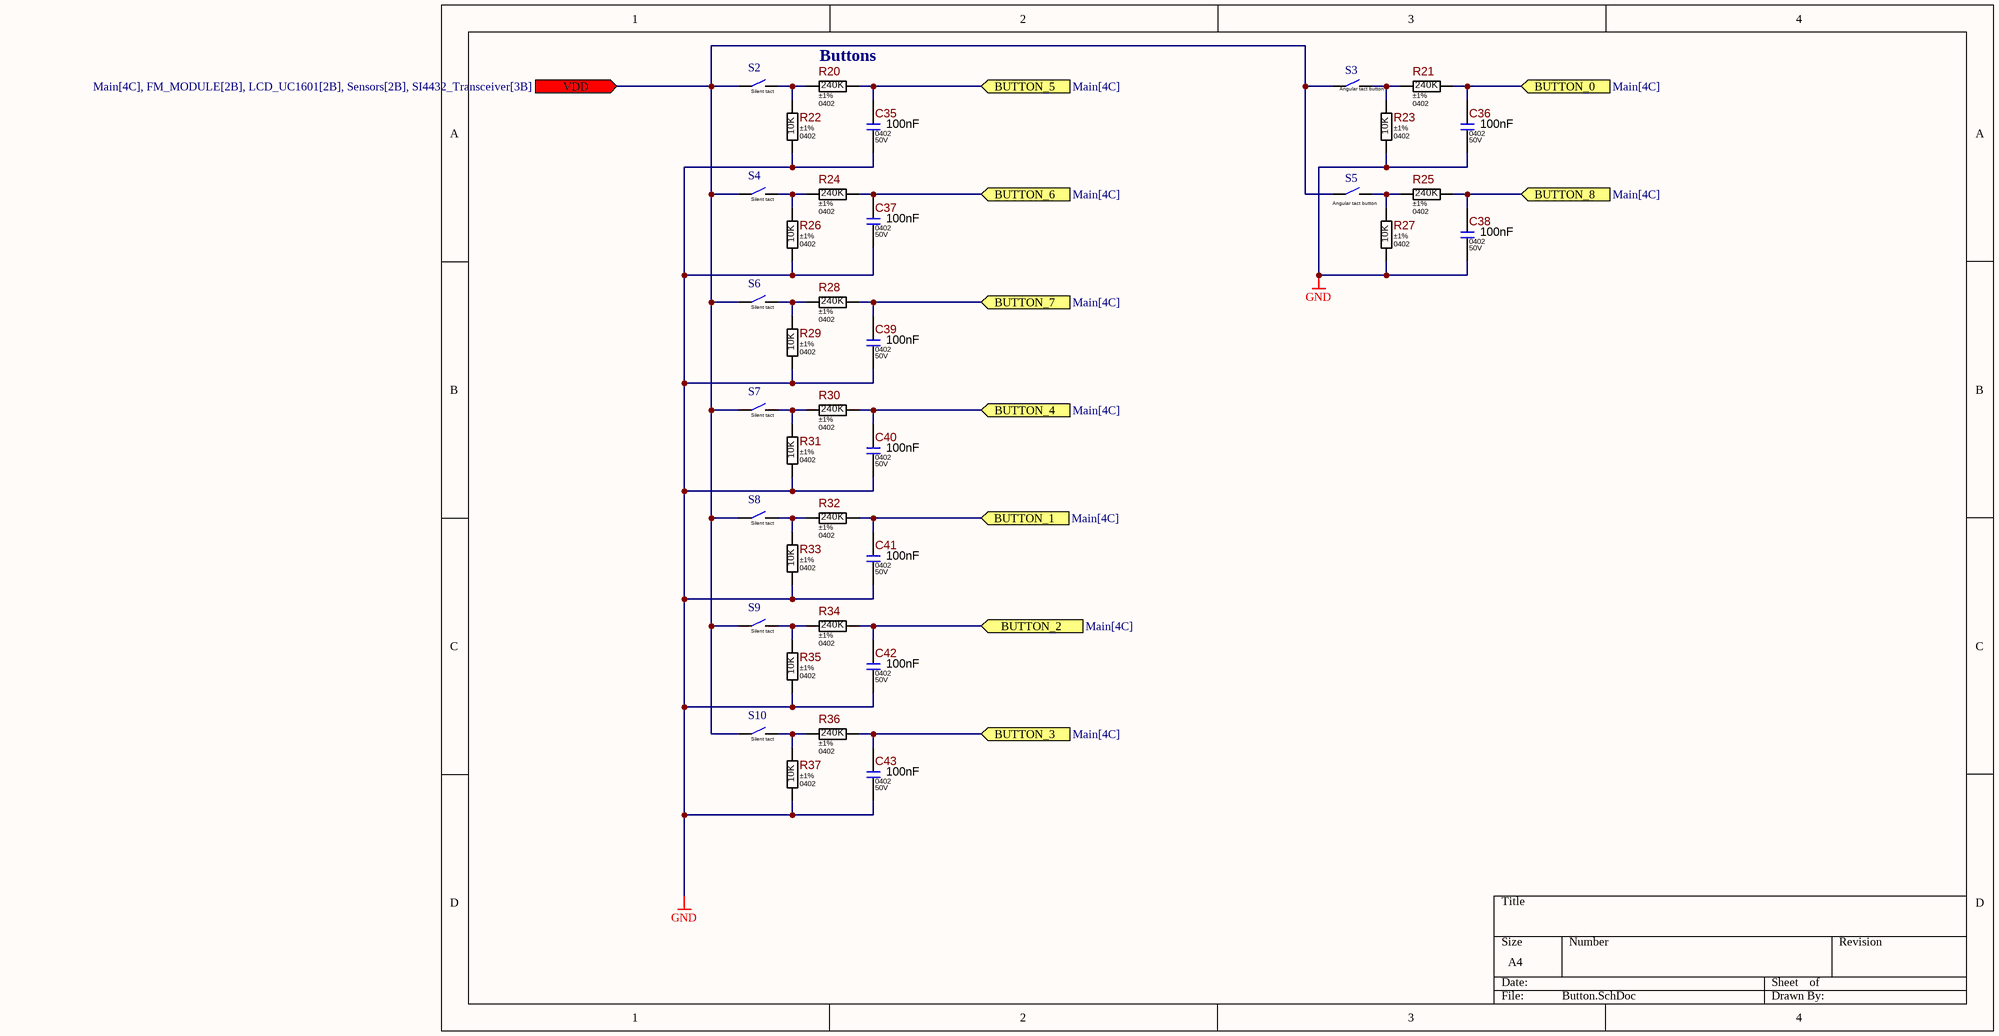
[diagram p6: Button.SchDoc]

### Parts
C35  Package: 0402  Voltage: 50V  [Cap_0402]  (hidden comment: 100nF)
C36  Package: 0402  Voltage: 50V  [Cap_0402]  (hidden comment: 100nF)
C37  Package: 0402  Voltage: 50V  [Cap_0402]  (hidden comment: 100nF)
C38  Package: 0402  Voltage: 50V  [Cap_0402]  (hidden comment: 100nF)
C39  Package: 0402  Voltage: 50V  [Cap_0402]  (hidden comment: 100nF)
C40  Package: 0402  Voltage: 50V  [Cap_0402]  (hidden comment: 100nF)
C41  Package: 0402  Voltage: 50V  [Cap_0402]  (hidden comment: 100nF)
C42  Package: 0402  Voltage: 50V  [Cap_0402]  (hidden comment: 100nF)
C43  Package: 0402  Voltage: 50V  [Cap_0402]  (hidden comment: 100nF)
R20  value 240K  Tolerance: ±1%  Package: 0402  [Res_0402]  (hidden comment: Res_0402_240K)
R21  value 240K  Tolerance: ±1%  Package: 0402  [Res_0402]  (hidden comment: Res_0402_240K)
R22  value 10K  Tolerance: ±1%  Package: 0402  [Res_0402]  (hidden comment: Res_0402_10K)
R23  value 10K  Tolerance: ±1%  Package: 0402  [Res_0402]  (hidden comment: Res_0402_10K)
R24  value 240K  Tolerance: ±1%  Package: 0402  [Res_0402]  (hidden comment: Res_0402_240K)
R25  value 240K  Tolerance: ±1%  Package: 0402  [Res_0402]  (hidden comment: Res_0402_240K)
R26  value 10K  Tolerance: ±1%  Package: 0402  [Res_0402]  (hidden comment: Res_0402_10K)
R27  value 10K  Tolerance: ±1%  Package: 0402  [Res_0402]  (hidden comment: Res_0402_10K)
R28  value 240K  Tolerance: ±1%  Package: 0402  [Res_0402]  (hidden comment: Res_0402_240K)
R29  value 10K  Tolerance: ±1%  Package: 0402  [Res_0402]  (hidden comment: Res_0402_10K)
R30  value 240K  Tolerance: ±1%  Package: 0402  [Res_0402]  (hidden comment: Res_0402_240K)
R31  value 10K  Tolerance: ±1%  Package: 0402  [Res_0402]  (hidden comment: Res_0402_10K)
R32  value 240K  Tolerance: ±1%  Package: 0402  [Res_0402]  (hidden comment: Res_0402_240K)
R33  value 10K  Tolerance: ±1%  Package: 0402  [Res_0402]  (hidden comment: Res_0402_10K)
R34  value 240K  Tolerance: ±1%  Package: 0402  [Res_0402]  (hidden comment: Res_0402_240K)
R35  value 10K  Tolerance: ±1%  Package: 0402  [Res_0402]  (hidden comment: Res_0402_10K)
R36  value 240K  Tolerance: ±1%  Package: 0402  [Res_0402]  (hidden comment: Res_0402_240K)
R37  value 10K  Tolerance: ±1%  Package: 0402  [Res_0402]  (hidden comment: Res_0402_10K)
S2  Name: Silent tact  [Tact Switch_6*6*5mm]  (hidden comment: Silent Tact Switch)
S3  Angular tact button  [Tact_button_3X6X3.5mm]
S4  Name: Silent tact  [Tact Switch_6*6*5mm]  (hidden comment: Silent Tact Switch)
S5  Angular tact button  [Tact_button_3X6X3.5mm]
S6  Name: Silent tact  [Tact Switch_6*6*5mm]  (hidden comment: Silent Tact Switch)
S7  Name: Silent tact  [Tact Switch_6*6*5mm]  (hidden comment: Silent Tact Switch)
S8  Name: Silent tact  [Tact Switch_6*6*5mm]  (hidden comment: Silent Tact Switch)
S9  Name: Silent tact  [Tact Switch_6*6*5mm]  (hidden comment: Silent Tact Switch)
S10  Name: Silent tact  [Tact Switch_6*6*5mm]  (hidden comment: Silent Tact Switch)

### Ports
BUTTON_0 (in, see Main[4C]), BUTTON_1 (in, see Main[4C]), BUTTON_2 (in, see Main[4C]), BUTTON_3 (in, see Main[4C]), BUTTON_4 (in, see Main[4C]), BUTTON_5 (in, see Main[4C]), BUTTON_6 (in, see Main[4C]), BUTTON_7 (in, see Main[4C]), BUTTON_8 (in, see Main[4C]), VDD (in, see Main[4C], FM_MODULE[2B], LCD_UC1601[2B], Sensors[2B], SI4432_Transceiver[3B])

### Nets
3V3: S2.1 S3.1 S4.1 S5.1 S6.1 S7.1 S8.1 S9.1 S10.1 ; port VDD
GND: C35.2 C36.2 C37.2 C38.2 C39.2 C40.2 C41.2 C42.2 C43.2 R22.2 R23.2 R26.2 R27.2 R29.2 R31.2 R33.2 R35.2 R37.2
BUTTON_0: C36.1 R21.2 ; port BUTTON_0
BUTTON_1: C41.1 R32.2 ; port BUTTON_1
BUTTON_2: C42.1 R34.2 ; port BUTTON_2
BUTTON_3: C43.1 R36.2 ; port BUTTON_3
BUTTON_4: C40.1 R30.2 ; port BUTTON_4
BUTTON_5: C35.1 R20.2 ; port BUTTON_5
BUTTON_6: C37.1 R24.2 ; port BUTTON_6
BUTTON_7: C39.1 R28.2 ; port BUTTON_7
BUTTON_8: C38.1 R25.2 ; port BUTTON_8
NetR20_1: R20.1 R22.1 S2.2
NetR21_1: R21.1 R23.1 S3.2
NetR24_1: R24.1 R26.1 S4.2
NetR25_1: R25.1 R27.1 S5.2
NetR28_1: R28.1 R29.1 S6.2
NetR30_1: R30.1 R31.1 S7.2
NetR32_1: R32.1 R33.1 S8.2
NetR34_1: R34.1 R35.1 S9.2
NetR36_1: R36.1 R37.1 S10.2

### Notes on the sheet
- (near R20) Buttons

### Library data of the parts
C35-C43 = Cap_0402_100nF: 100nF 50V  ±25% 0402 Ceramic Capacitor; Component Type: SMD; Tolerance: ±25%; ComponentLink1URL: https://search.murata.co.jp/Ceramy/image/img/A01X/G101/ENG/GRM31CR60J107ME39-01.pdf; ComponentLink1Description: Datasheet; Value: 100nF
R20 R21 R24 R25 R28 R30 R32 R34 R36 = Res_0402_240K: ±1% 1/16W 0402; Power Rating: 0.062W; Voltage: 50V; ComponentLink1URL: https://www.yageo.com/upload/media/product/productsearch/datasheet/rchip/PYu-RC_Group_51_RoHS_L_10.pdf; ComponentLink1Description: Datasheet
R22 R23 R26 R27 R29 R31 R33 R35 R37 = Res_0402_10K: as R1 on sheet Main; ComponentLink1URL: https://www.yageo.com/upload/media/product/productsearch/datasheet/rchip/PYu-RC_Group_51_RoHS_L_10.pdf; ComponentLink1Description: Datasheet
S2 S4 S6-S10 = Silent Tact Switch: 6*6*5mm Smd Silicone Button Switch
S3 S5 = Angular tact button: 3X6X3.5mm; Name: Angular tact button

## Sheet mic_amp.SchDoc
size A4; SheetNumber: 8; SheetTotal: 11
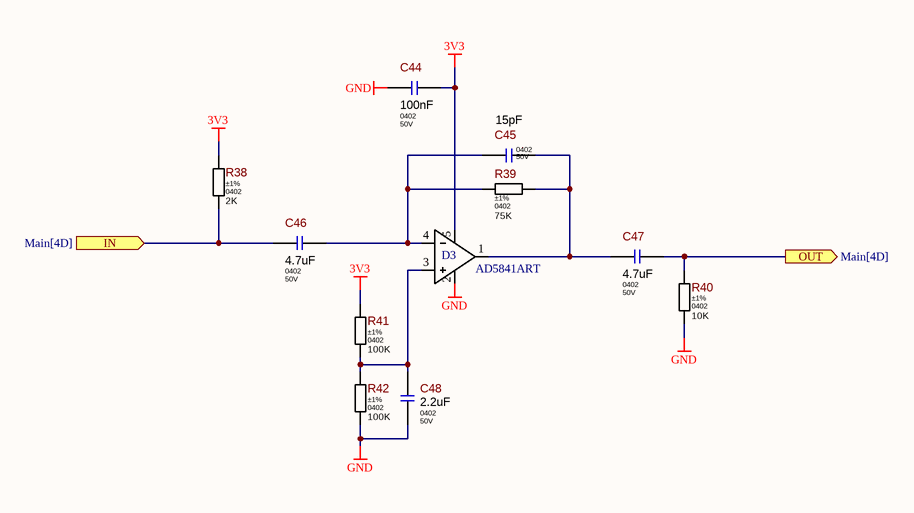
[diagram p7: mic_amp.SchDoc]

### Parts
C44  Package: 0402  Voltage: 50V  [Cap_0402]  (hidden comment: 100nF)
C45  Package: 0402  Voltage: 50V  [Cap_0402]  (hidden comment: 15pF)
C46  Package: 0402  Voltage: 50V  [Cap_0402]  (hidden comment: 4.7uF)
C47  Package: 0402  Voltage: 50V  [Cap_0402]  (hidden comment: 4.7uF)
C48  Package: 0402  Voltage: 50V  [Cap_0402]  (hidden comment: 2.2uF)
D3  AD5841ART  [SOT-23-5]
R38  value 2K  Tolerance: ±1%  Package: 0402  [Res_0402]  (hidden comment: Res_0402_2K)
R39  value 75K  Tolerance: ±1%  Package: 0402  [Res_0402]  (hidden comment: Res_0402_75K)
R40  value 10K  Tolerance: ±1%  Package: 0402  [Res_0402]  (hidden comment: Res_0402_10K)
R41  value 100K  Tolerance: ±1%  Package: 0402  [Res_0402]  (hidden comment: Res_0402_100K)
R42  value 100K  Tolerance: ±1%  Package: 0402  [Res_0402]  (hidden comment: Res_0402_100K)

### Ports
IN (in, see Main[4D]), OUT (out, see Main[4D])

### Nets
3V3: C44.2 D3.5 R38.1 R41.1
GND: C44.1 C48.2 D3.2 R40.2 R42.2
MIC: C47.2 R40.1 ; port OUT
NetC45_1: C45.1 C46.2 D3.4 R39.1
NetC45_2: C45.2 C47.1 D3.1 R39.2
NetC46_1: C46.1 R38.2 ; port IN
NetC48_1: C48.1 D3.3 R41.2 R42.1

### Library data of the parts
C44 = Cap_0402_100nF: 100nF 50V  ±25% 0402 Ceramic Capacitor; Component Type: SMD; Tolerance: ±25%; ComponentLink1URL: https://search.murata.co.jp/Ceramy/image/img/A01X/G101/ENG/GRM31CR60J107ME39-01.pdf; ComponentLink1Description: Datasheet; Value: 100nF
C45 = Cap_0402_15pF: 15pF 50V  ±25% 0402 Ceramic Capacitor; Component Type: SMD; Tolerance: ±25%; ComponentLink1URL: https://search.murata.co.jp/Ceramy/image/img/A01X/G101/ENG/GRM31CR60J107ME39-01.pdf; ComponentLink1Description: Datasheet; Value: 15pF
C46 C47 = Cap_0402_4.7uF: 4.7uF 50V  ±25% 0402 Ceramic Capacitor; Component Type: SMD; Tolerance: ±25%; ComponentLink1URL: https://search.murata.co.jp/Ceramy/image/img/A01X/G101/ENG/GRM31CR60J107ME39-01.pdf; ComponentLink1Description: Datasheet; Value: 4.7uF
C48 = Cap_0402_2.2uF: 2.2uF 50V  ±25% 0402 Ceramic Capacitor; Component Type: SMD; Tolerance: ±25%; ComponentLink1URL: https://search.murata.co.jp/Ceramy/image/img/A01X/G101/ENG/GRM31CR60J107ME39-01.pdf; ComponentLink1Description: Datasheet; Value: 2.2uF
D3 = AD5841ART: CMOS Rail to Rail 1Mhz 2.7-5.5v
R38 = Res_0402_2K: ±1% 1/16W 0402; Power Rating: 0.062W; Voltage: 50V; ComponentLink1URL: https://www.yageo.com/upload/media/product/productsearch/datasheet/rchip/PYu-RC_Group_51_RoHS_L_10.pdf; ComponentLink1Description: Datasheet
R39 = Res_0402_75K: as R14 on sheet Supply; ComponentLink1URL: https://www.yageo.com/upload/media/product/productsearch/datasheet/rchip/PYu-RC_Group_51_RoHS_L_10.pdf; ComponentLink1Description: Datasheet
R40 = Res_0402_10K: as R1 on sheet Main; ComponentLink1URL: https://www.yageo.com/upload/media/product/productsearch/datasheet/rchip/PYu-RC_Group_51_RoHS_L_10.pdf; ComponentLink1Description: Datasheet
R41 R42 = Res_0402_100K: ±1% 1/16W 0402; Power Rating: 0.062W; Voltage: 50V; ComponentLink1URL: https://www.yageo.com/upload/media/product/productsearch/datasheet/rchip/PYu-RC_Group_51_RoHS_L_10.pdf; ComponentLink1Description: Datasheet

## Sheet LEDS.SchDoc
size A4; SheetNumber: 9; SheetTotal: 11
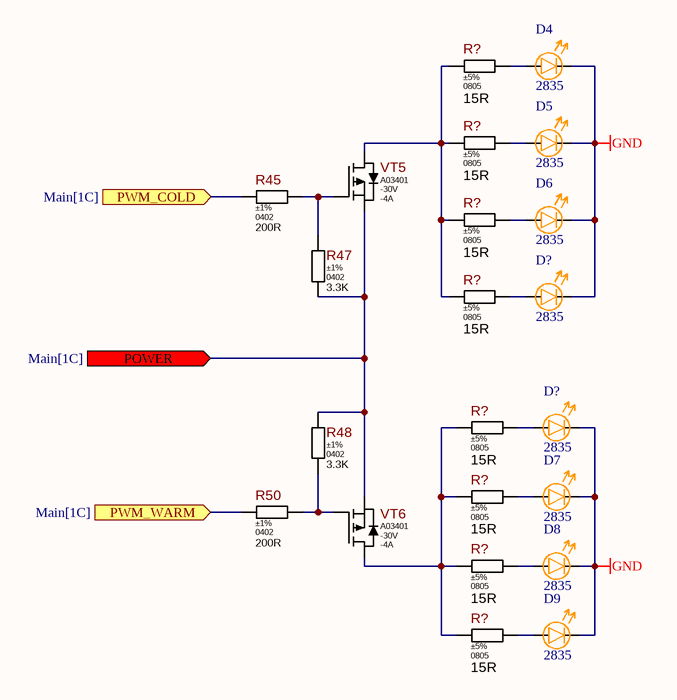
[diagram p8: LEDS.SchDoc]

### Parts
(Parts that share a designator on the sheet are numbered #1, #2 ... from top to bottom, then left to right.)
D4  2835  [2835 LED]
D5  2835  [2835 LED]
D6  2835  [2835 LED]
D7  2835  [2835 LED]
D8  2835  [2835 LED]
D9  2835  [2835 LED]
D?#4  2835  [2835 LED]
D?#5  2835  [2835 LED]
R45  value 200R  Tolerance: ±1%  Package: 0402  [Res_0402]  (hidden comment: Res_0402_200R)
R47  value 3.3K  Tolerance: ±1%  Package: 0402  [Res_0402]  (hidden comment: Res_0402_3.3K)
R48  value 3.3K  Tolerance: ±1%  Package: 0402  [Res_0402]  (hidden comment: Res_0402_3.3K)
R50  value 200R  Tolerance: ±1%  Package: 0402  [Res_0402]  (hidden comment: Res_0402_200R)
R?#9  value 15R  Tolerance: ±5%  Package: 0805  [Res_0805]  (hidden comment: Res_0805_15R)
R?#10  value 15R  Tolerance: ±5%  Package: 0805  [Res_0805]  (hidden comment: Res_0805_15R)
R?#11  value 15R  Tolerance: ±5%  Package: 0805  [Res_0805]  (hidden comment: Res_0805_15R)
R?#12  value 15R  Tolerance: ±5%  Package: 0805  [Res_0805]  (hidden comment: Res_0805_15R)
R?#13  value 15R  Tolerance: ±5%  Package: 0805  [Res_0805]  (hidden comment: Res_0805_15R)
R?#14  value 15R  Tolerance: ±5%  Package: 0805  [Res_0805]  (hidden comment: Res_0805_15R)
R?#15  value 15R  Tolerance: ±5%  Package: 0805  [Res_0805]  (hidden comment: Res_0805_15R)
R?#16  value 15R  Tolerance: ±5%  Package: 0805  [Res_0805]  (hidden comment: Res_0805_15R)
VT5  Vds: -30V  Id: -4A  [SOT-23]  (hidden comment: A03401)
VT6  Vds: -30V  Id: -4A  [SOT-23]  (hidden comment: A03401)

### Ports
POWER (in, see Main[1C]), PWM_COLD (in, see Main[1C]), PWM_WARM (in, see Main[1C])

### Nets
BAT+: R47.2 R48.1 VT5.2(S) VT6.2(S) ; port POWER
GND: D4.1(C) D5.1(C) D6.1(C) D7.1(C) D8.1(C) D9.1(C) D?#4.1(C) D?#5.1(C)
LED_COLD: R45.1 ; port PWM_COLD
LED_WARM: R50.1 ; port PWM_WARM
NetD4_2: D4.2(A) R?#9.2
NetD5_2: D5.2(A) R?#10.2
NetD6_2: D6.2(A) R?#11.2
NetD7_2: D7.2(A) R?#14.2
NetD8_2: D8.2(A) R?#15.2
NetD9_2: D9.2(A) R?#16.2
NetD?#4_2: D?#4.2(A) R?#12.2
NetD?#5_2: D?#5.2(A) R?#13.2
NetR45_2: R45.2 R47.1 VT5.1(G)
NetR48_2: R48.2 R50.2 VT6.1(G)
NetR?#9_1: R?#9.1 R?#10.1 R?#11.1 R?#12.1 VT5.3(D)
NetR?#13_1: R?#13.1 R?#14.1 R?#15.1 R?#16.1 VT6.3(D)

### Library data of the parts
D4-D9 D?#4 D?#5 = 2835 Led: 2835 Led 2.85v 150mA
R45 R50 = Res_0402_200R: as R12 on sheet LCD_UC1601; ComponentLink1URL: https://www.yageo.com/upload/media/product/productsearch/datasheet/rchip/PYu-RC_Group_51_RoHS_L_10.pdf; ComponentLink1Description: Datasheet
R47 R48 = Res_0402_3.3K: as R11 on sheet LCD_UC1601; ComponentLink1URL: https://www.yageo.com/upload/media/product/productsearch/datasheet/rchip/PYu-RC_Group_51_RoHS_L_10.pdf; ComponentLink1Description: Datasheet
R?#9-R?#16 = Res_0805_15R: ±5% 1/8W 0805; Power Rating: 0.062W; Voltage: 50V; ComponentLink1URL: https://www.yageo.com/upload/media/product/productsearch/datasheet/rchip/PYu-RC_Group_51_RoHS_L_10.pdf; ComponentLink1Description: Datasheet
VT5 VT6 = A03401: as VT4 on sheet LCD_UC1601; Part Type: N-Channel; Component Type: SMD; ComponentLink1URL: https://datasheetspdf.com/pdf-file/767558/Alpha&OmegaSemiconductors/AO3416/1; ComponentLink1Description: Datasheet; Package: SOT-23; Rds: 60mOhm; Name: A03401

## Sheet SPI_ROM.SchDoc
size A4; SheetNumber: 10; SheetTotal: 11
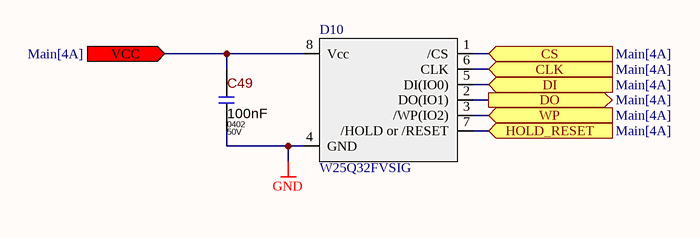
[diagram p9: SPI_ROM.SchDoc]

### Parts
C49  Package: 0402  Voltage: 50V  [Cap_0402]  (hidden comment: 100nF)
D10  W25Q32FVSIG  [SOIC8]

### Ports
CLK (in, see Main[4A]), CS (in, see Main[4A]), DI (in, see Main[4A]), DO (out, see Main[4A]), HOLD_RESET (in, see Main[4A]), VCC (in, see Main[4A]), WP (in, see Main[4A])

### Nets
3V3: C49.1 D10.8(Vcc) ; port VCC
GND: C49.2 D10.4(GND)
FLASH_CS: D10.1(/CS) ; port CS
FLASH_HOLD: D10.7(/HOLD_or_/RESET) ; port HOLD_RESET
FLASH_WP: D10.3(/WP(IO2)) ; port WP
SPI2_MISO: D10.2(DO(IO1)) ; port DO
SPI2_MOSI: D10.5(DI(IO0)) ; port DI
SPI2_SCK: D10.6(CLK) ; port CLK

### Library data of the parts
C49 = Cap_0402_100nF: 100nF 50V  ±25% 0402 Ceramic Capacitor; Component Type: SMD; Tolerance: ±25%; ComponentLink1URL: https://search.murata.co.jp/Ceramy/image/img/A01X/G101/ENG/GRM31CR60J107ME39-01.pdf; ComponentLink1Description: Datasheet; Value: 100nF
D10 = W25Q32FVSIG: SPI\QSPI Flash 4MB

## Sheet Sensors.SchDoc
size A4; SheetNumber: 11; SheetTotal: 11
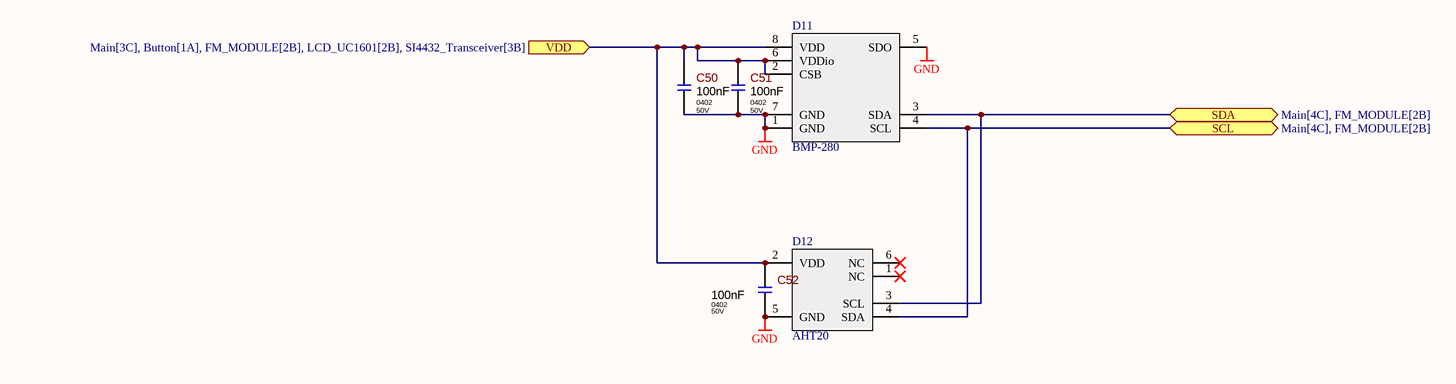
[diagram p10: Sensors.SchDoc]

### Parts
C50  Package: 0402  Voltage: 50V  [Cap_0402]  (hidden comment: 100nF)
C51  Package: 0402  Voltage: 50V  [Cap_0402]  (hidden comment: 100nF)
C52  Package: 0402  Voltage: 50V  [Cap_0402]  (hidden comment: 100nF)
D11  BMP-280  [BMP-280]
D12  AHT20  [AHT20]

### Ports
SCL (bidir, see Main[4C], FM_MODULE[2B]), SDA (bidir, see Main[4C], FM_MODULE[2B]), VDD (in, see Main[3C], Button[1A], FM_MODULE[2B], LCD_UC1601[2B], SI4432_Transceiver[3B])

### Nets
3V3: C50.1 C51.1 C52.1 D11.2(CSB) D11.6(VDDio) D11.8(VDD) D12.2(VDD) ; port VDD
GND: C50.2 C51.2 C52.2 D11.1(GND) D11.5(SDO) D11.7(GND) D12.5(GND)
SCL: D11.4(SCL) D12.4(SDA) ; port SCL
SDA: D11.3(SDA) D12.3(SCL) ; port SDA

Not connected (* = marked no-connect by the designer): D12 1(NC)* 6(NC)*

### Library data of the parts
C50-C52 = Cap_0402_100nF: 100nF 50V  ±25% 0402 Ceramic Capacitor; Component Type: SMD; Tolerance: ±25%; ComponentLink1URL: https://search.murata.co.jp/Ceramy/image/img/A01X/G101/ENG/GRM31CR60J107ME39-01.pdf; ComponentLink1Description: Datasheet; Value: 100nF
D12 = AHT20: Temperature and humidity sensor -40+85 0-100% / 1.8-3.3v; Name: AHT20

## Nets that join several sheets
3V3: Main (14 pins), LCD_UC1601 (5 pins), Supply (C26.1 C27.1 L4.2 R17.1), SI4432_Transceiver (C29.1 C30.1 M2.8), FM_MODULE (C34.1 M3.5), Button (9 pins), mic_amp (C44.2 D3.5 R38.1 R41.1), SPI_ROM (C49.1 D10.8), Sensors (7 pins)
A3V3: Main (6 pins), Speaker_out (C?#12.1 C?#13.1 D?#2.6 D?#3.6)
BAT+: Speaker_out (R?#5.1), Supply (8 pins), LEDS (R47.2 R48.1 VT5.2 VT6.2)
GND: Main (26 pins), LCD_UC1601 (6 pins), Speaker_out (C?#4.2 C?#5.2 C?#6.2 C?#7.2), Supply (15 pins), SI4432_Transceiver (6 pins), FM_MODULE (C33.2 C34.2 L7.2 M3.6), Button (18 pins), mic_amp (5 pins), LEDS (8 pins), SPI_ROM (C49.2 D10.4), Sensors (7 pins)
BAT_MEAS: Main (DD1.50), Supply (C25.2 R14.2 R16.1)
DAC_L: Main (DD1.20), Speaker_out (C?#8.1)
DAC_R: Main (DD1.21), Speaker_out (C?#10.1)
LCD_CD: Main (DD1.58), LCD_UC1601 (W1.CD)
LCD_RST: Main (DD1.59), LCD_UC1601 (W1.RST)
NetC33_1: Main (X2.1), FM_MODULE (C33.1 L7.1 M3.10)
NetC46_1: Main (M1.1), mic_amp (C46.1 R38.2)
SCL: Main (DD1.61), Speaker_out (D?#2.5), FM_MODULE (M3.2), Sensors (D11.4 D12.4)
SDA: Main (DD1.62), Speaker_out (D?#2.4), FM_MODULE (M3.1), Sensors (D11.3 D12.3)
SPI1_CS: Main (DD1.2), LCD_UC1601 (W1.CS)
SPI1_MOSI: Main (DD1.57), LCD_UC1601 (W1.SDA)
SPI1_SCK: Main (DD1.55), LCD_UC1601 (W1.SCK)
SPI2_MISO: SI4432_Transceiver (M2.7), SPI_ROM (D10.2)
SPI2_MOSI: SI4432_Transceiver (M2.6), SPI_ROM (D10.5)
SPI2_SCK: SI4432_Transceiver (M2.5), SPI_ROM (D10.6)
VSYS: Main (D?#1.5 VD1.2 X1.2), Supply (C23.1 D1.4 D1.8 R13.1)